# EAGLE design spotmicrojetson (EAGLE 9.6.2)
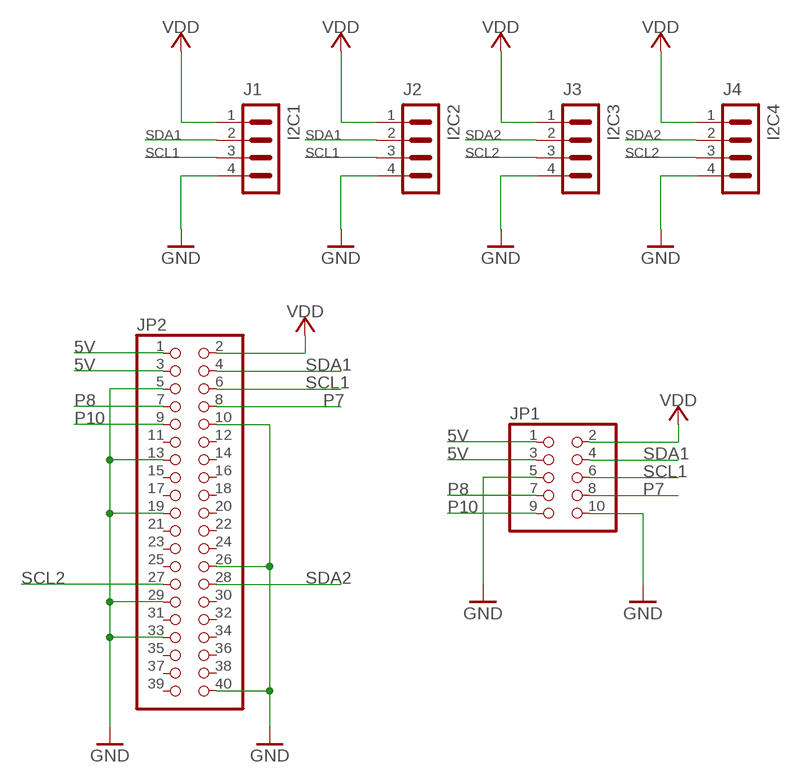
[diagram p0: schematic, sheet 1]

## Parts
J1  I2C1  CON_HEADER_1X04_JST_B4B-PH-SM4-TB(LF)(SN)  [CON_JST_B4B-PH-SM4-TB(LF)(SN)]
J2  I2C2  CON_HEADER_1X04_JST_B4B-PH-SM4-TB(LF)(SN)  [CON_JST_B4B-PH-SM4-TB(LF)(SN)]
J3  I2C3  CON_HEADER_1X04_JST_B4B-PH-SM4-TB(LF)(SN)  [CON_JST_B4B-PH-SM4-TB(LF)(SN)]
J4  I2C4  CON_HEADER_1X04_JST_B4B-PH-SM4-TB(LF)(SN)  [CON_JST_B4B-PH-SM4-TB(LF)(SN)]
JP1  PINHD-2X5SMT  [2X05_SMT]
JP2  PINHD-2X20SMT  [2X20_SMT]

## Nets
5V: JP1.1 JP1.3 JP2.1 JP2.3
GND: J1.4 J2.4 J3.4 J4.4 JP1.5 JP1.10 JP2.5 JP2.10 JP2.13 JP2.19 JP2.26 JP2.29 JP2.33 JP2.40
P7: JP1.8 JP2.8
P8: JP1.7 JP2.7
P10: JP1.9 JP2.9
SCL1: J1.3 J2.3 JP1.6 JP2.6
SCL2: J3.3 J4.3 JP2.27
SDA1: J1.2 J2.2 JP1.4 JP2.4
SDA2: J3.2 J4.2 JP2.28
VDD: J1.1 J2.1 J3.1 J4.1 JP1.2 JP2.2
Unconnected: JP2.11 JP2.12 JP2.14 JP2.15 JP2.16 JP2.17 JP2.18 JP2.20 JP2.21 JP2.22 JP2.23 JP2.24 JP2.25 JP2.30 JP2.31 JP2.32 JP2.34 JP2.35 JP2.36 JP2.37 JP2.38 JP2.39

## Library data of the parts
J1-J4 = carro:CON_HEADER_1X04
JP1 = pinhead+:PINHD-2X5: PIN HEADER
JP2 = pinhead+:PINHD-2X20: PIN HEADER

## Board
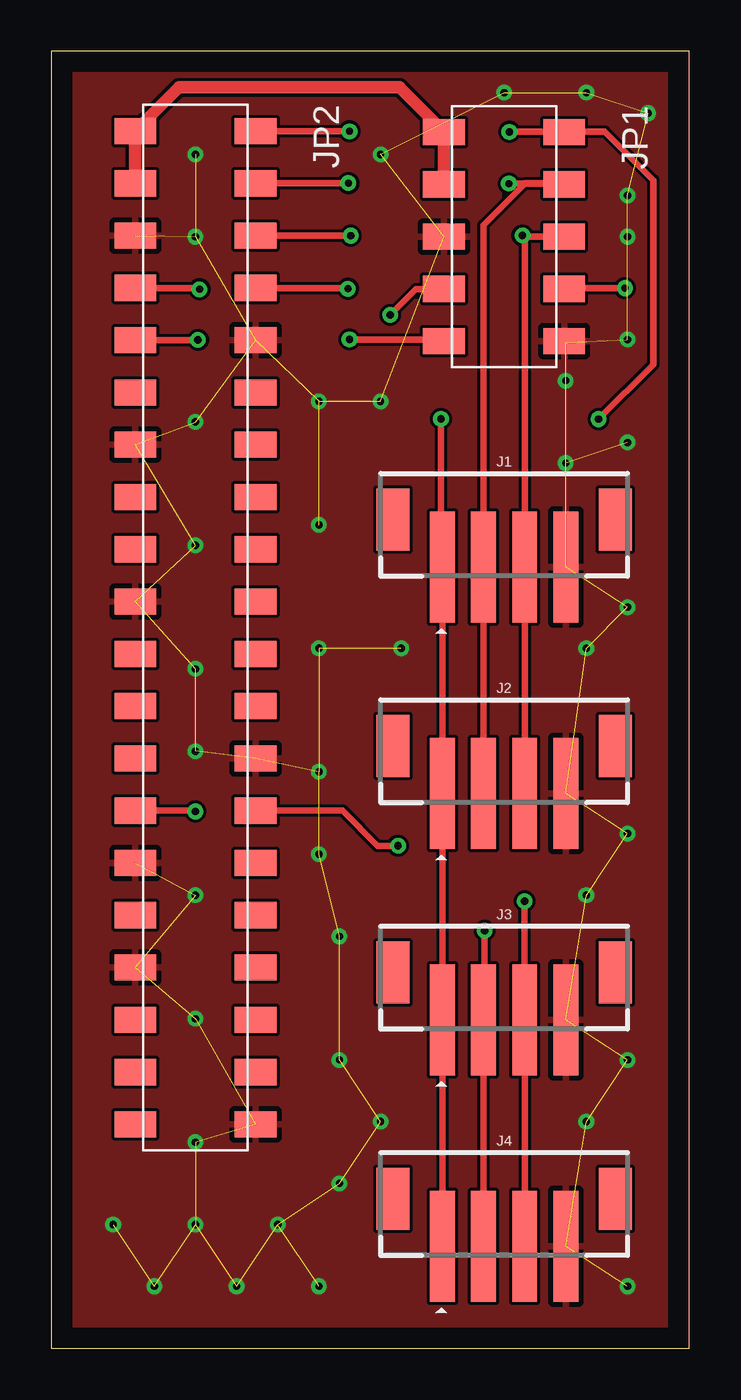
[diagram p1: board, top side]
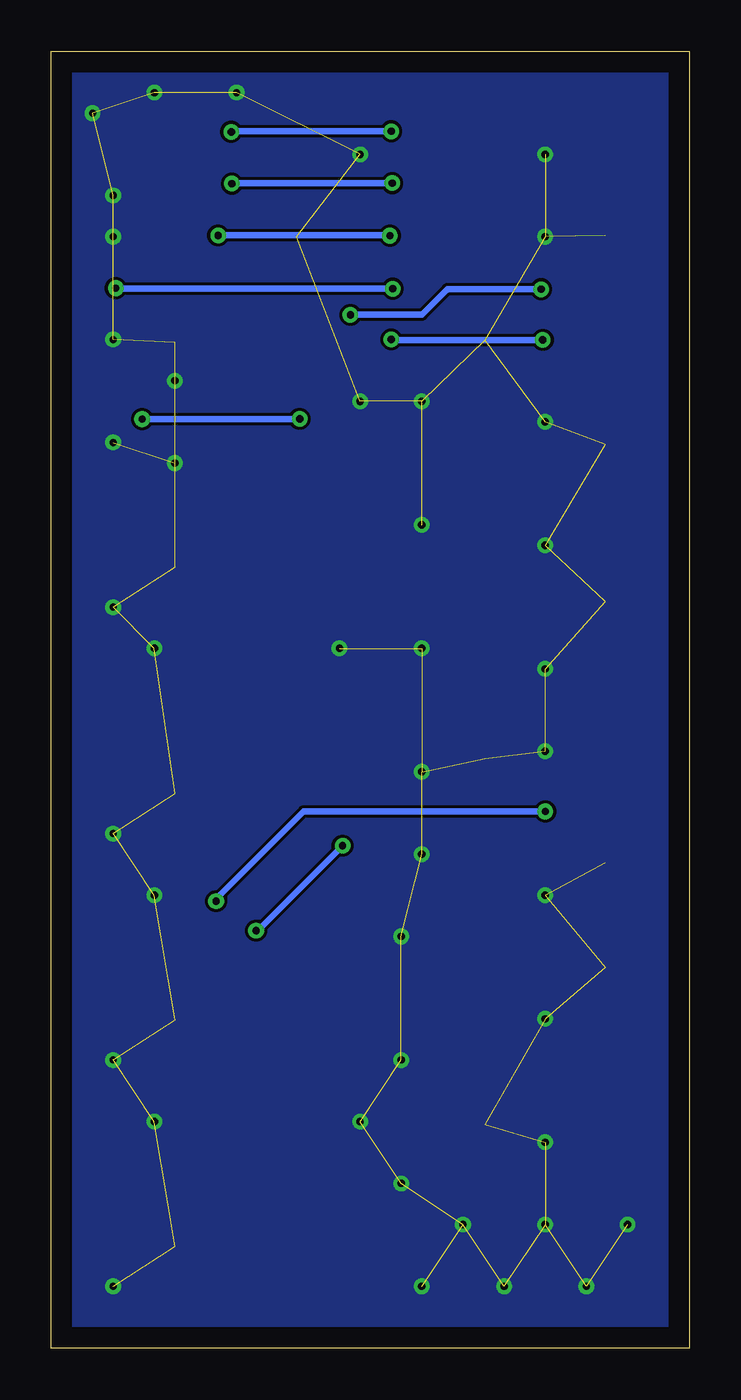
[diagram p2: board, bottom side, seen from below]

Size 31 x 63 mm. Coordinates in mm from the lower left corner, seen from the top.
Outline: 0,0 31,0 31,63 0,63 0,0
Copper layers (1*16): Top 0.035mm / dielectric 1.5mm / Bottom 0.035mm
Design rules "default": minimum track width 6mil, minimum drill 0.35mm, track to track 6mil, track to pad 6mil, pad to pad 6mil, via to via 6mil, smd to smd 6mil, copper to edge 40mil, drill to drill 6mil, minimum pad ring 10mil, minimum via ring 8mil, stop-mask expansion 4mil, vias tented up to drill 0mil, thermal gap 10mil

### Footprints (pad centres in the part's own frame; a part is rotated, then mirrored left to right if it is on the bottom)
CON_JST_B4B-PH-SM4-TB(LF)(SN) = smd 1.2 x 5.4: 1 -3,-1.05; 2 -1,-1.05; 3 1,-1.05; 4 3,-1.05 | smd 1.6 x 3: NC@1 -5.4,1.25; NC@2 5.4,1.25
2X05_SMT = smd 1.27 x 2.032: 1 -5.08,-2.921; 2 -5.08,2.921; 3 -2.54,-2.921; 4 -2.54,2.921; 5 0,-2.921; 6 0,2.921; 7 2.54,-2.921; 8 2.54,2.921; 9 5.08,-2.921; 10 5.08,2.921
2X20_SMT = smd 1.27 x 2.032: 1 -24.13,-2.921; 2 -24.13,2.921; 3 -21.59,-2.921; 4 -21.59,2.921; 5 -19.05,-2.921; 6 -19.05,2.921; 7 -16.51,-2.921; 8 -16.51,2.921; 9 -13.97,-2.921; 10 -13.97,2.921; 11 -11.43,-2.921; 12 -11.43,2.921; 13 -8.89,-2.921; 14 -8.89,2.921; 15 -6.35,-2.921; 16 -6.35,2.921; 17 -3.81,-2.921; 18 -3.81,2.921; 19 -1.27,-2.921; 20 -1.27,2.921; 21 1.27,2.921; 22 1.27,-2.921; 23 3.81,-2.921; 24 3.81,2.921; 25 6.35,-2.921; 26 6.35,2.921; 27 8.89,-2.921; 28 8.89,2.921; 29 11.43,-2.921; 30 11.43,2.921; 31 13.97,-2.921; 32 13.97,2.921; 33 16.51,-2.921; 34 16.51,2.921; 35 19.05,-2.921; 36 19.05,2.921; 37 21.59,-2.921; 38 21.59,2.921; 39 24.13,-2.921; 40 24.13,2.921

### Placement (x,y rotation side)
J1  22,39 0 top
J2  22,28 0 top
J3  22,17 0 top
J4  22,6 0 top
JP1  22,54 270 top
JP2  7,35 270 top

### Tracks (layer width: path | path; a pad name or v marks a point on that pad's centre or on a via)
5V
  Top 0.61: JP2.3 JP2.1 6.2,61.25 16.93,61.25 19.08,59.1 JP1.1 JP1.3
GND  (via drill 0.35)  (56 unrouted)
  Top 0.305: 25,48.84 JP1.10
  other vias: 13,3 9,3 5,3 3,6 7,6 11,6 14,8 14,14 14,20 13,24 13,28 13,34 17,34 13,40 13,46 16,46 26,11 28,14 26,22 28,25 26,34 28,36 25,47 28,49 28,54 28,56 7,54 7,58 7,45 7,39 7,33 7,29 7,22 7,16 7,10 29,60 28,44 25,43 16,11 16,58 22,61 26,61 28,3
  pour Top: -2,65 33,65 33,-2 -2,-2
  pour Bottom: -4,67 35,67 35,-4 -4,-4
P7  (via drill 0.35)
  Top 0.305: JP2.8 14.42,51.51 14.44,51.5 v14.41,51.47 | v27.87,51.5 24.96,51.5 JP1.8
  Bottom 0.305: v14.41,51.47 27.7,51.47 27.77,51.4 v27.87,51.5
P8  (via drill 0.35)
  Top 0.305: JP2.7 7.13,51.51 v7.2,51.45 | v16.47,50.2 17.73,51.46 JP1.7
  Bottom 0.305: v7.2,51.45 11.74,51.45 12.99,50.2 v16.47,50.2
P10  (via drill 0.35)
  Top 0.305: JP2.9 7.08,48.97 7.1,48.96 v7.12,48.98 | v14.49,49.01 18.99,49.01 JP1.9
  Bottom 0.305: v7.12,48.98 14.31,48.98 14.39,48.91 v14.49,49.01
SCL1  (via drill 0.35)
  Top 0.305: J2.3 J1.3 23,53.96 v22.9,54.06 22.96,54 JP1.6 | JP2.6 14.42,54.05 14.49,54.11 v14.55,54.05
  Bottom 0.305: v14.55,54.05 14.56,54.06 v22.9,54.06
SCL2  (via drill 0.35)
  Top 0.305: J4.3 23,14.41 | 23,14.41 J3.3 | JP2.27 6.96,26.11 v6.99,26.07 | v23,21.71 23,14.42 23,14.41
  Bottom 0.305: v6.99,26.07 18.74,26.07 23.05,21.76 v23,21.71
SDA1  (via drill 0.35)
  Top 0.305: J2.2 J1.2 21,54.56 23.05,56.6 24.86,56.6 | 24.86,56.6 JP1.4 | JP2.4 14.35,56.59 14.39,56.55 v14.44,56.6 | v22.23,56.58 24.83,56.58 24.86,56.6
  Bottom 0.305: v14.44,56.6 22.16,56.6 22.21,56.55 v22.23,56.58
SDA2  (via drill 0.35)
  Top 0.305: J4.2 21,14.67 | 21,14.67 J3.2 | JP2.28 14.15,26.11 15.85,24.41 v16.85,24.41 | v21.05,20.28 21.05,14.72 21,14.67
  Bottom 0.305: v16.85,24.41 20.98,20.28 v21.05,20.28
VDD  (via drill 0.35)
  Top 0.305: J4.1 J3.1 J2.1 J1.1 18.93,38.02 v18.93,45.15 | JP1.2 25.08,59.08 25.07,59.09 | 26.63,45.1 v26.59,45.14 29.24,47.79 29.24,56.76 26.91,59.09 25.07,59.09 | JP2.2 9.93,59.12 v14.49,59.12 | v22.26,59.09 25.07,59.09
  Bottom 0.305: v26.59,45.14 19,45.14 18.98,45.15 v18.93,45.15 | v14.49,59.12 22.26,59.12 v22.26,59.09